# EAGLE design pololu-steppers-signal-side (EAGLE 5.06)
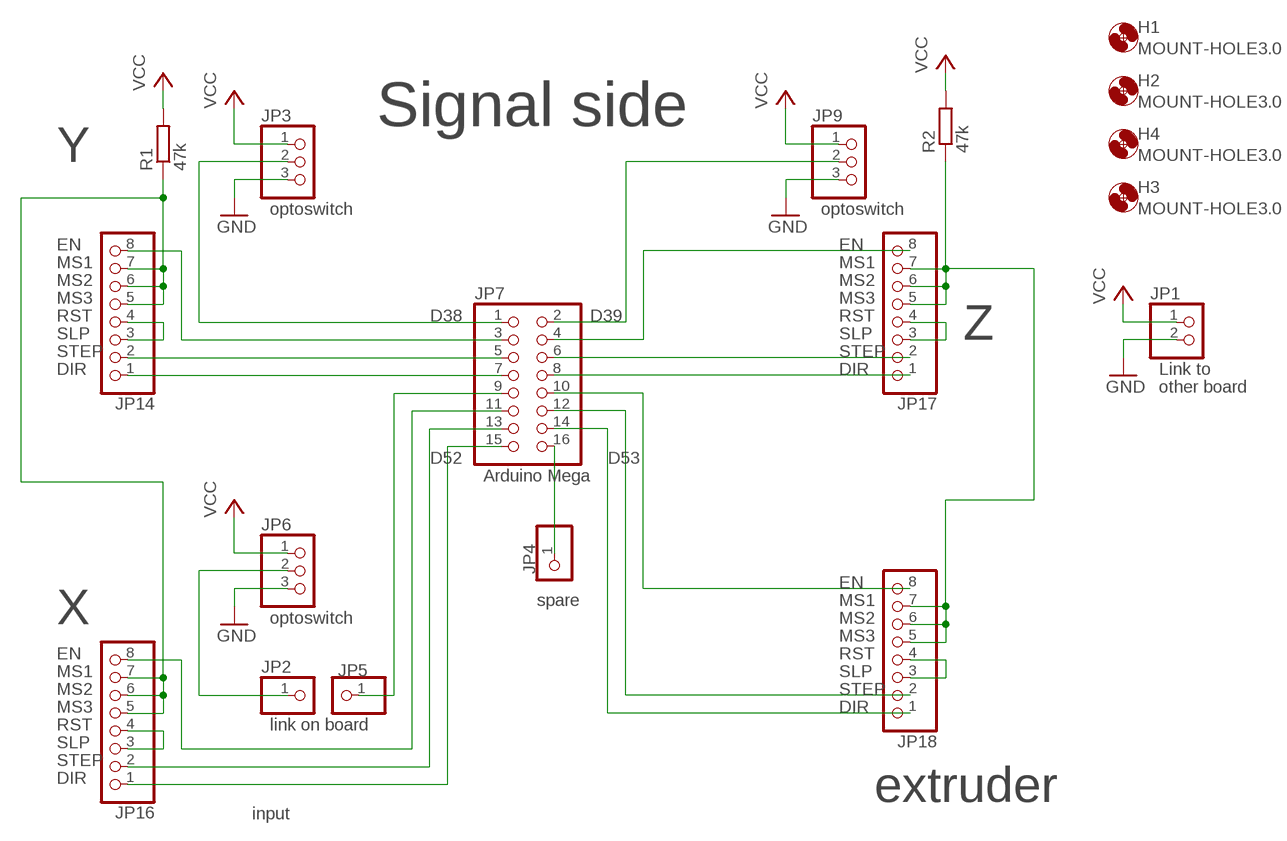
[diagram p0: schematic, sheet 1]

## Parts
H1  MOUNT-HOLE3.0  [3,0]
H2  MOUNT-HOLE3.0  [3,0]
H3  MOUNT-HOLE3.0  [3,0]
H4  MOUNT-HOLE3.0  [3,0]
JP1  PINHD-1X2  [1X02]
JP2  PINHD-1X1  [1X01]
JP3  PINHD-1X3  [1X03]
JP4  PINHD-1X1  [1X01]
JP5  PINHD-1X1  [1X01]
JP6  PINHD-1X3  [1X03]
JP7  PINHD-2X8  [2X08]
JP9  PINHD-1X3  [1X03]
JP14  PINHD-1X8  [1X08]
JP16  PINHD-1X8  [1X08]
JP17  PINHD-1X8  [1X08]
JP18  PINHD-1X8  [1X08]
R1  47k  R-EU_0204/5  [0204/5]
R2  47k  R-EU_0204/5  [0204/5]

## Nets
EDIR: JP7.14 JP18.1
EEN: JP7.10 JP18.8
ESTEP: JP7.12 JP18.2
GND: JP1.2 JP3.3 JP6.3 JP9.3
MICROSTEP1: JP17.5 JP17.6 JP17.7 JP18.5 JP18.6 JP18.7 R2.1
MICROSTEP2: JP14.5 JP14.6 JP14.7 JP16.5 JP16.6 JP16.7 R1.1
N$1: JP2.1 JP6.2
N$2: JP16.3 JP16.4
N$3: JP4.1 JP7.16
N$7: JP14.3 JP14.4
N$22: JP17.3 JP17.4
N$32: JP18.3 JP18.4
VCC: JP1.1 JP3.1 JP6.1 JP9.1 R1.2 R2.2
XDIR: JP7.15 JP16.1
XEN: JP7.11 JP16.8
XOPT: JP5.1 JP7.9
XSTEP: JP7.13 JP16.2
YDIR: JP7.7 JP14.1
YEN: JP7.3 JP14.8
YOPT: JP3.2 JP7.1
YSTEP: JP7.5 JP14.2
ZDIR: JP7.8 JP17.1
ZEN: JP7.4 JP17.8
ZOPT: JP7.2 JP9.2
ZSTEP: JP7.6 JP17.2

## Notes on the sheet
- Signal side
- Y
- optoswitch | optoswitch
- EN | EN
- MS1 | MS1
- MS2 | MS2
- MS3 | MS3
- RST | D38 | D39 | RST
- SLP | SLP | Z
- STEP | STEP
- DIR | DIR | Link to
- other board
- D52 | D53
- Arduino Mega
- EN
- spare | MS1
- X | optoswitch | MS2
- MS3
- EN | RST
- MS1 | SLP
- MS2 | STEP
- MS3 | DIR
- RST | link on board
- SLP
- STEP
- DIR
- extruder
- input

## Library data of the parts
H1-H4 = holes:MOUNT-HOLE: MOUNTING HOLE with drill center marker
JP1 = pinhead:PINHD-1X2: PIN HEADER
JP2 JP4 JP5 = pinhead:PINHD-1X1: PIN HEADER
JP3 JP6 JP9 = pinhead:PINHD-1X3: PIN HEADER
JP7 = pinhead:PINHD-2X8: PIN HEADER
JP14 JP16-JP18 = pinhead:PINHD-1X8: PIN HEADER
R1 R2 = rcl:R-EU_: RESISTOR, European symbol

## Board
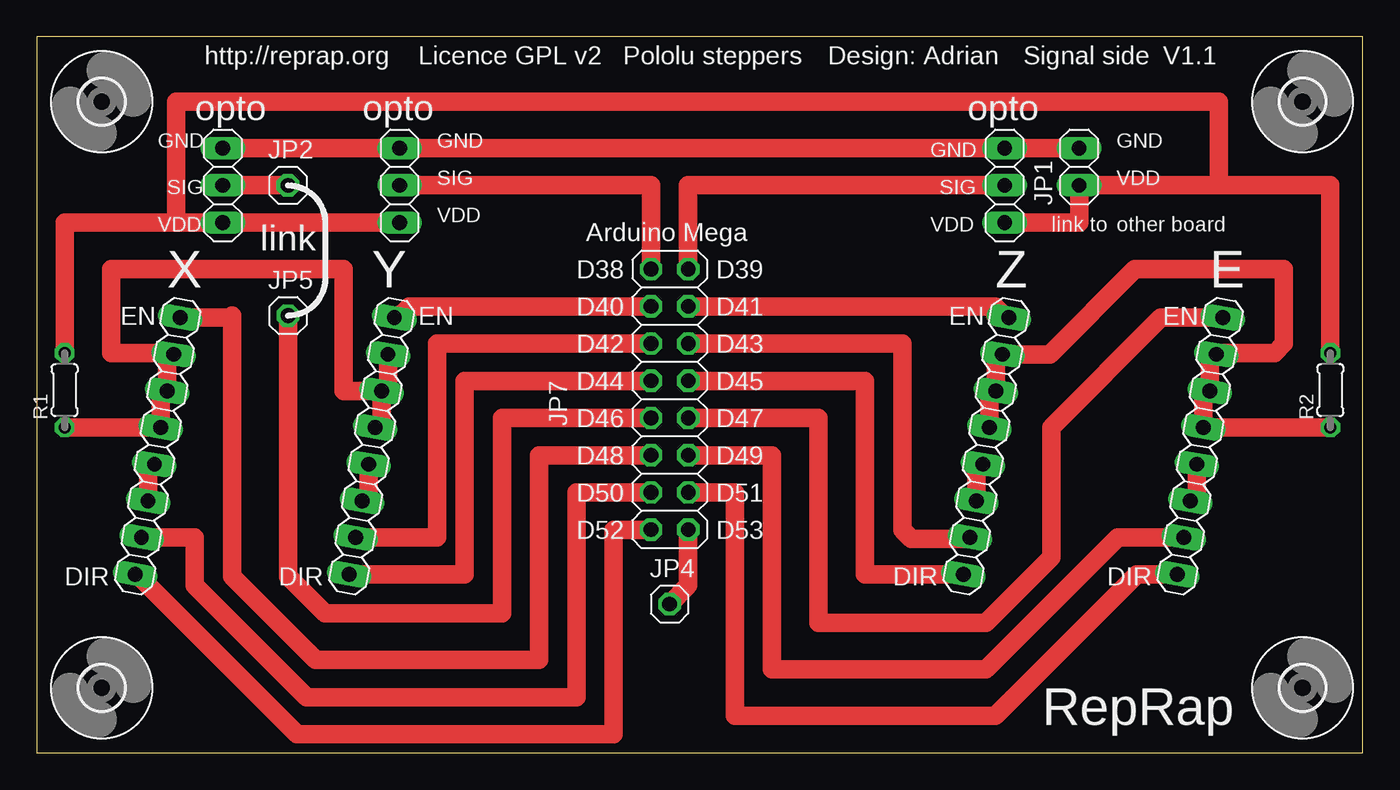
[diagram p1: board, top side]

Size 90.47 x 48.88 mm. Coordinates in mm from the lower left corner, seen from the top.
Outline: 0,0 90.47,0 90.47,48.88 0,48.88 0,0
Copper layers (1*16): Top 0.035mm / dielectric 1.5mm / Bottom 0.035mm
Design rules "default": minimum track width 10mil, minimum drill 24mil, track to track 8mil, track to pad 8mil, pad to pad 8mil, via to via 8mil, smd to smd 8mil, copper to edge 40mil, drill to drill 8mil, minimum pad ring 10mil, minimum via ring 8mil, stop-mask expansion 4mil, vias tented up to drill 0mil, thermal gap 10mil

### Footprints (pad centres in the part's own frame; a part is rotated, then mirrored left to right if it is on the bottom)
3,0 = hole 3: 0,0
1X02 = drill 1.016 long: 1 -1.27,0; 2 1.27,0
1X01 = drill 1.016 octagon: 1 0,0
1X03 = drill 1.016 long: 1 -2.54,0; 2 0,0; 3 2.54,0
2X08 = drill 1.016 octagon: 1 -8.89,-1.27; 2 -8.89,1.27; 3 -6.35,-1.27; 4 -6.35,1.27; 5 -3.81,-1.27; 6 -3.81,1.27; 7 -1.27,-1.27; 8 -1.27,1.27; 9 1.27,-1.27; 10 1.27,1.27; 11 3.81,-1.27; 12 3.81,1.27; 13 6.35,-1.27; 14 6.35,1.27; 15 8.89,-1.27; 16 8.89,1.27
1X08 = drill 1.016 long: 1 -8.89,0; 2 -6.35,0; 3 -3.81,0; 4 -1.27,0; 5 1.27,0; 6 3.81,0; 7 6.35,0; 8 8.89,0
0204/5 = drill 0.813 octagon: 1 -2.54,0; 2 2.54,0

### Placement (x,y rotation side)
H1  4.45,4.45 0 top
H2  86.36,4.45 0 top
H3  4.45,44.45 0 top
H4  86.36,44.45 0 top
JP1  71.12,40.01 90 top
JP2  17.14,38.73 0 top
JP3  24.77,38.73 90 top
JP4  43.18,10.16 0 top
JP5  17.14,29.84 0 top
JP6  12.7,38.73 90 top
JP7  43.18,24.13 270 top
JP9  66.04,38.73 90 top
JP14  22.86,20.95 80 top
JP16  8.26,20.95 80 top
JP17  64.77,20.95 80 top
JP18  79.38,20.95 80 top
R1  1.91,24.77 90 top
R2  88.27,24.77 90 top

### Tracks (layer width: path | path; a pad name or v marks a point on that pad's centre or on a via)
EDIR
  Top 1.27: JP18.1 75.06,12.2 65.41,2.54 54.61,2.54 | 54.61,2.54 53.98,2.54 | JP7.14 47.62,17.78 47.62,2.54 54.61,2.54
EEN
  Top 1.27: JP18.8 76.7,29.71 69.22,22.23 69.22,13.34 64.77,8.89 53.34,8.89 53.34,22.86 JP7.10
ESTEP
  Top 1.27: JP18.2 73.76,14.7 64.77,5.71 54.61,5.71 | 54.61,5.71 53.98,5.71 | JP7.12 50.16,20.32 50.16,5.71 54.61,5.71
GND
  Top 1.27: JP6.3 JP3.3 JP9.3 JP1.2
MICROSTEP1
  Top 1.27: JP17.5 64.99,24.27 JP17.6 65.43,26.77 JP17.7 69.12,27.21 74.93,33.02 85.09,33.02 85.09,27.94 84.45,27.3 80.57,27.3 JP18.7 80.04,26.77 JP18.6 79.6,24.27 JP18.5 88.25,22.21 R2.1
MICROSTEP2
  Top 1.27: JP14.6 20.95,24.71 20.95,33.02 5.08,33.02 5.08,27.3 9.36,27.3 JP16.7 8.92,27.21 JP16.6 8.48,24.71 JP16.5 1.91,22.21 R1.1 | JP14.7 23.96,25.15 JP14.6 | JP14.6 23.52,22.65 JP14.5
N$1
  Top 1.27: JP6.2 JP2.1
N$2
  Top 1.27: JP16.4 7.59,19.7 JP16.3
N$3
  Top 1.27: JP7.16 44.45,11.43 JP4.1
N$7
  Top 1.27: JP14.4 22.64,17.64 JP14.3
N$22
  Top 1.27: JP17.3 64.11,19.26 JP17.4
N$32
  Top 1.27: JP18.4 79.15,17.64 JP18.3
VCC
  Top 1.27: 80.64,38.73 JP1.1 71.12,36.2 JP9.1 | 80.64,38.73 88.27,38.73 R2.2 | 9.53,36.2 JP6.1 JP3.1 | 9.53,36.2 9.53,44.45 80.64,44.45 80.64,38.73 | 9.53,36.2 1.91,36.2 R1.2
XDIR
  Top 1.27: JP7.15 39.37,15.24 39.37,1.27 17.78,1.27 6.85,12.2 JP16.1
XEN
  Top 1.27: JP16.8 13.2,29.71 13.34,29.84 13.34,12.06 19.05,6.35 34.29,6.35 34.29,20.32 JP7.11
XOPT
  Top 1.27: JP5.1 17.14,12.06 19.68,9.53 30.48,9.53 | 30.48,9.53 31.11,9.53 | JP7.9 31.75,22.86 31.75,9.53 30.48,9.53
XSTEP
  Top 1.27: JP16.2 10.79,14.7 10.79,11.43 18.41,3.81 36.83,3.81 36.83,17.78 JP7.13
YDIR
  Top 1.27: JP14.1 29.21,12.2 29.21,24.13 | 29.21,24.13 29.21,24.77 | JP7.7 29.21,25.4 29.21,24.13
YEN
  Top 1.27: 24.54,29.84 JP14.8 24.63,29.71 25.4,30.48 JP7.3
YOPT
  Top 1.27: JP3.2 41.91,38.73 JP7.1
YSTEP
  Top 1.27: JP14.2 27.3,14.7 27.3,25.4 | 27.3,25.4 27.3,26.04 | JP7.5 27.3,27.94 27.3,25.4
ZDIR
  Top 1.27: 56.52,12.2 58.92,12.2 | 56.52,12.2 JP17.1 | JP7.8 56.52,25.4 56.52,12.2
ZEN
  Top 1.27: 65.41,29.84 65.54,29.71 JP17.8 66.17,29.71 65.41,30.48 JP7.4
ZOPT
  Top 1.27: JP9.2 44.45,38.73 JP7.2
ZSTEP
  Top 1.27: JP7.6 59.05,27.94 59.05,15.24 59.69,14.61 63.57,14.61 JP17.2

### Text on the board
tPlace: http://reprap.org | Licence GPL v2 | Pololu steppers | Design: Adrian | Signal side | V1.1 | opto | opto | opto | GND | GND | GND | GND | SIG | VDD | SIG | SIG | VDD | VDD | VDD | link to | other board | Arduino Mega | link | X | Y | D38 | D39 | Z | E | D40 | D41 | EN | EN | EN | EN | D42 | D43 | D44 | D45 | D46 | D47 | D48 | D49 | D50 | D51 | D52 | D53 | DIR | DIR | DIR | DIR | RepRap